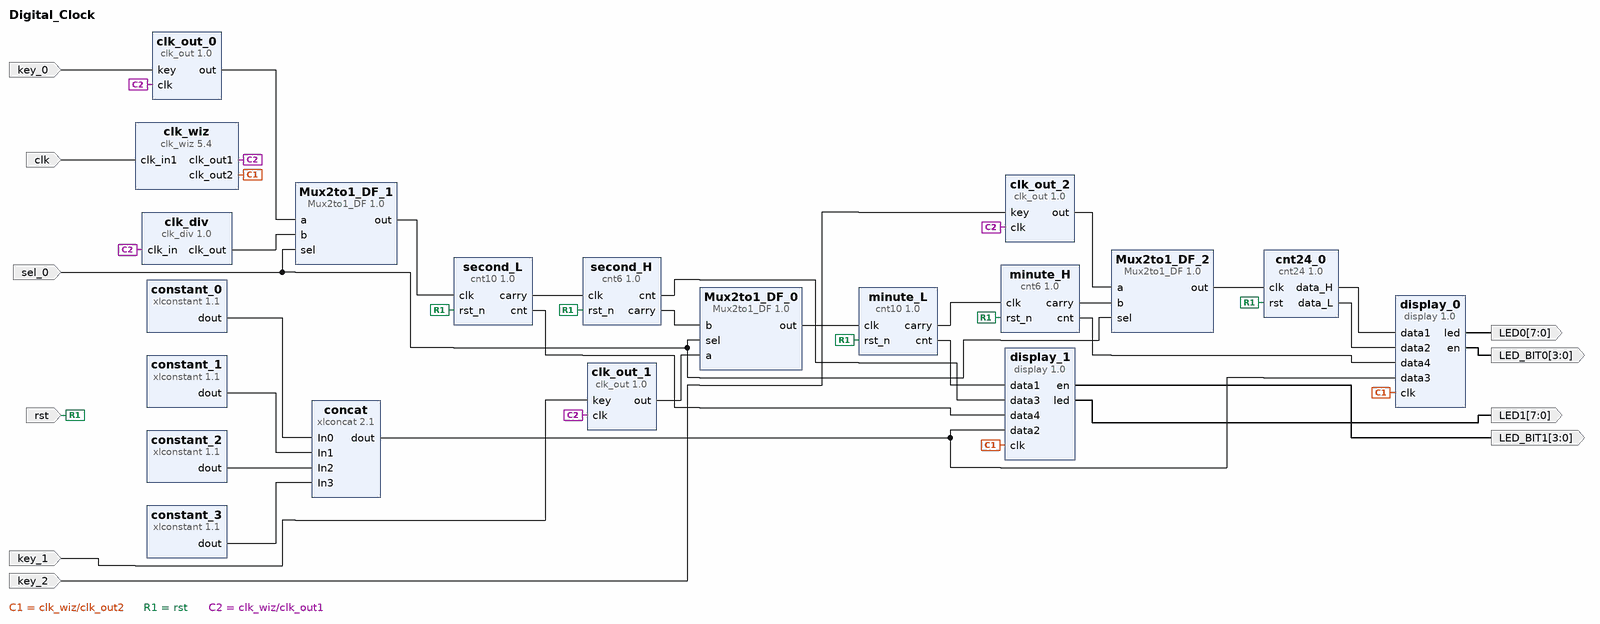
[diagram p0: block diagram of the top level]
# Vivado block design Digital_Clock, xc7a35tcsg324-1, Vivado 2017.4
create_bd_design Digital_Clock

create_bd_port -dir I -type rst rst
create_bd_port -dir O -from 3 -to 0 LED_BIT0
create_bd_port -dir O -from 7 -to 0 LED0
create_bd_port -dir O -from 3 -to 0 LED_BIT1
create_bd_port -dir O -from 7 -to 0 LED1
create_bd_port -dir I sel_0
create_bd_port -dir I -type clk clk
create_bd_port -dir I key_0
create_bd_port -dir I key_1
create_bd_port -dir I key_2

create_bd_cell -type ip -vlnv xilinx.com:ip:clk_wiz:5.4 clk_wiz
set_property -dict [list \
  CONFIG.PRIMITIVE PLL \
  CONFIG.CLKOUT2_USED true \
  CONFIG.NUM_OUT_CLKS 2 \
  CONFIG.CLKOUT1_DRIVES BUFG \
  CONFIG.CLKOUT2_DRIVES BUFG \
  CONFIG.CLKOUT3_DRIVES BUFG \
  CONFIG.CLKOUT4_DRIVES BUFG \
  CONFIG.CLKOUT5_DRIVES BUFG \
  CONFIG.CLKOUT6_DRIVES BUFG \
  CONFIG.CLKOUT7_DRIVES BUFG \
  CONFIG.USE_LOCKED false \
  CONFIG.USE_RESET false \
  CONFIG.MMCM_DIVCLK_DIVIDE 1 \
  CONFIG.MMCM_CLKFBOUT_MULT_F 9 \
  CONFIG.MMCM_COMPENSATION ZHOLD \
  CONFIG.MMCM_CLKOUT0_DIVIDE_F 9 \
  CONFIG.MMCM_CLKOUT1_DIVIDE 9 \
  CONFIG.CLKOUT1_JITTER 137.681 \
  CONFIG.CLKOUT1_PHASE_ERROR 105.461 \
  CONFIG.CLKOUT2_JITTER 137.681 \
  CONFIG.CLKOUT2_PHASE_ERROR 105.461 \
] [get_bd_cells clk_wiz]
create_bd_cell -type ip -vlnv xilinx.com:user:clk_div:1.0 clk_div
create_bd_cell -type ip -vlnv xilinx.com:user:cnt10:1.0 second_L
create_bd_cell -type ip -vlnv xilinx.com:user:cnt6:1.0 second_H
create_bd_cell -type ip -vlnv xilinx.com:user:cnt10:1.0 minute_L
create_bd_cell -type ip -vlnv xilinx.com:user:cnt6:1.0 minute_H
create_bd_cell -type ip -vlnv xilinx.com:user:display:1.0 display_1
create_bd_cell -type ip -vlnv xilinx.com:user:display:1.0 display_0
create_bd_cell -type ip -vlnv xilinx.com:ip:xlconstant:1.1 constant_3
create_bd_cell -type ip -vlnv xilinx.com:ip:xlconstant:1.1 constant_1
create_bd_cell -type ip -vlnv xilinx.com:ip:xlconstant:1.1 constant_2
create_bd_cell -type ip -vlnv xilinx.com:ip:xlconstant:1.1 constant_0
create_bd_cell -type ip -vlnv xilinx.com:ip:xlconcat:2.1 concat
set_property -dict {CONFIG.NUM_PORTS 4} [get_bd_cells concat]
create_bd_cell -type ip -vlnv xilinx.com:user:Mux2to1_DF:1.0 Mux2to1_DF_0
create_bd_cell -type ip -vlnv xilinx.com:user:clk_out:1.0 clk_out_0
create_bd_cell -type ip -vlnv xilinx.com:user:Mux2to1_DF:1.0 Mux2to1_DF_1
create_bd_cell -type ip -vlnv xilinx.com:user:Mux2to1_DF:1.0 Mux2to1_DF_2
create_bd_cell -type ip -vlnv xilinx.com:user:clk_out:1.0 clk_out_1
create_bd_cell -type ip -vlnv xilinx.com:user:clk_out:1.0 clk_out_2
create_bd_cell -type ip -vlnv xilinx.com:user:cnt24:1.0 cnt24_0

# ---- connections ----

connect_bd_net [get_bd_pins second_L/carry] [get_bd_pins second_H/clk]
connect_bd_net -net cnt10_0_carry [get_bd_pins minute_L/carry] [get_bd_pins minute_H/clk]
connect_bd_net [get_bd_pins second_L/cnt] [get_bd_pins display_1/data4]
connect_bd_net [get_bd_pins second_H/cnt] [get_bd_pins display_1/data3]
connect_bd_net -net xlconstant_3_dout [get_bd_pins constant_0/dout] [get_bd_pins concat/In0]
connect_bd_net -net xlconstant_1_dout [get_bd_pins constant_1/dout] [get_bd_pins concat/In1]
connect_bd_net -net xlconstant_2_dout [get_bd_pins constant_2/dout] [get_bd_pins concat/In2]
connect_bd_net -net xlconstant_0_dout [get_bd_pins constant_3/dout] [get_bd_pins concat/In3]
connect_bd_net -net cnt10_0_cnt [get_bd_pins minute_L/cnt] [get_bd_pins display_1/data1]
connect_bd_net -net cnt6_0_cnt [get_bd_pins minute_H/cnt] [get_bd_pins display_0/data4]
connect_bd_net -net xlconcat_0_dout [get_bd_pins concat/dout] [get_bd_pins display_1/data2] [get_bd_pins display_0/data3]
connect_bd_net [get_bd_pins clk_wiz/clk_out2] [get_bd_pins display_0/clk] [get_bd_pins display_1/clk]
connect_bd_net -net rst_n_0_1 [get_bd_ports rst] \
  [get_bd_pins second_L/rst_n] [get_bd_pins second_H/rst_n] [get_bd_pins minute_L/rst_n] [get_bd_pins minute_H/rst_n] \
  [get_bd_pins cnt24_0/rst]
connect_bd_net [get_bd_pins clk_wiz/clk_out1] \
  [get_bd_pins clk_div/clk_in] [get_bd_pins clk_out_0/clk] [get_bd_pins clk_out_1/clk] [get_bd_pins clk_out_2/clk]
connect_bd_net [get_bd_pins display_0/en] [get_bd_ports LED_BIT0]
connect_bd_net [get_bd_pins display_0/led] [get_bd_ports LED0]
connect_bd_net [get_bd_pins display_1/en] [get_bd_ports LED_BIT1]
connect_bd_net [get_bd_pins display_1/led] [get_bd_ports LED1]
connect_bd_net [get_bd_pins Mux2to1_DF_0/out] [get_bd_pins minute_L/clk]
connect_bd_net [get_bd_pins second_H/carry] [get_bd_pins Mux2to1_DF_0/b]
connect_bd_net -net sel_0_1 [get_bd_ports sel_0] [get_bd_pins Mux2to1_DF_0/sel] [get_bd_pins Mux2to1_DF_1/sel] [get_bd_pins Mux2to1_DF_2/sel]
connect_bd_net [get_bd_pins clk_out_0/out] [get_bd_pins Mux2to1_DF_1/a]
connect_bd_net [get_bd_pins clk_out_1/out] [get_bd_pins Mux2to1_DF_0/a]
connect_bd_net [get_bd_pins clk_div/clk_out] [get_bd_pins Mux2to1_DF_1/b]
connect_bd_net [get_bd_pins Mux2to1_DF_1/out] [get_bd_pins second_L/clk]
connect_bd_net [get_bd_pins minute_H/carry] [get_bd_pins Mux2to1_DF_2/b]
connect_bd_net [get_bd_pins clk_out_2/out] [get_bd_pins Mux2to1_DF_2/a]
connect_bd_net [get_bd_ports clk] [get_bd_pins clk_wiz/clk_in1]
connect_bd_net -net key_0_1 [get_bd_ports key_0] [get_bd_pins clk_out_0/key]
connect_bd_net -net key_1_1 [get_bd_ports key_1] [get_bd_pins clk_out_1/key]
connect_bd_net -net key_2_1 [get_bd_ports key_2] [get_bd_pins clk_out_2/key]
connect_bd_net [get_bd_pins Mux2to1_DF_2/out] [get_bd_pins cnt24_0/clk]
connect_bd_net [get_bd_pins cnt24_0/data_H] [get_bd_pins display_0/data1]
connect_bd_net [get_bd_pins cnt24_0/data_L] [get_bd_pins display_0/data2]

validate_bd_design
save_bd_design
